# Altium schematic sheet TestProject.SchDoc
size A3; SheetNumber: 1; SheetTotal: 1
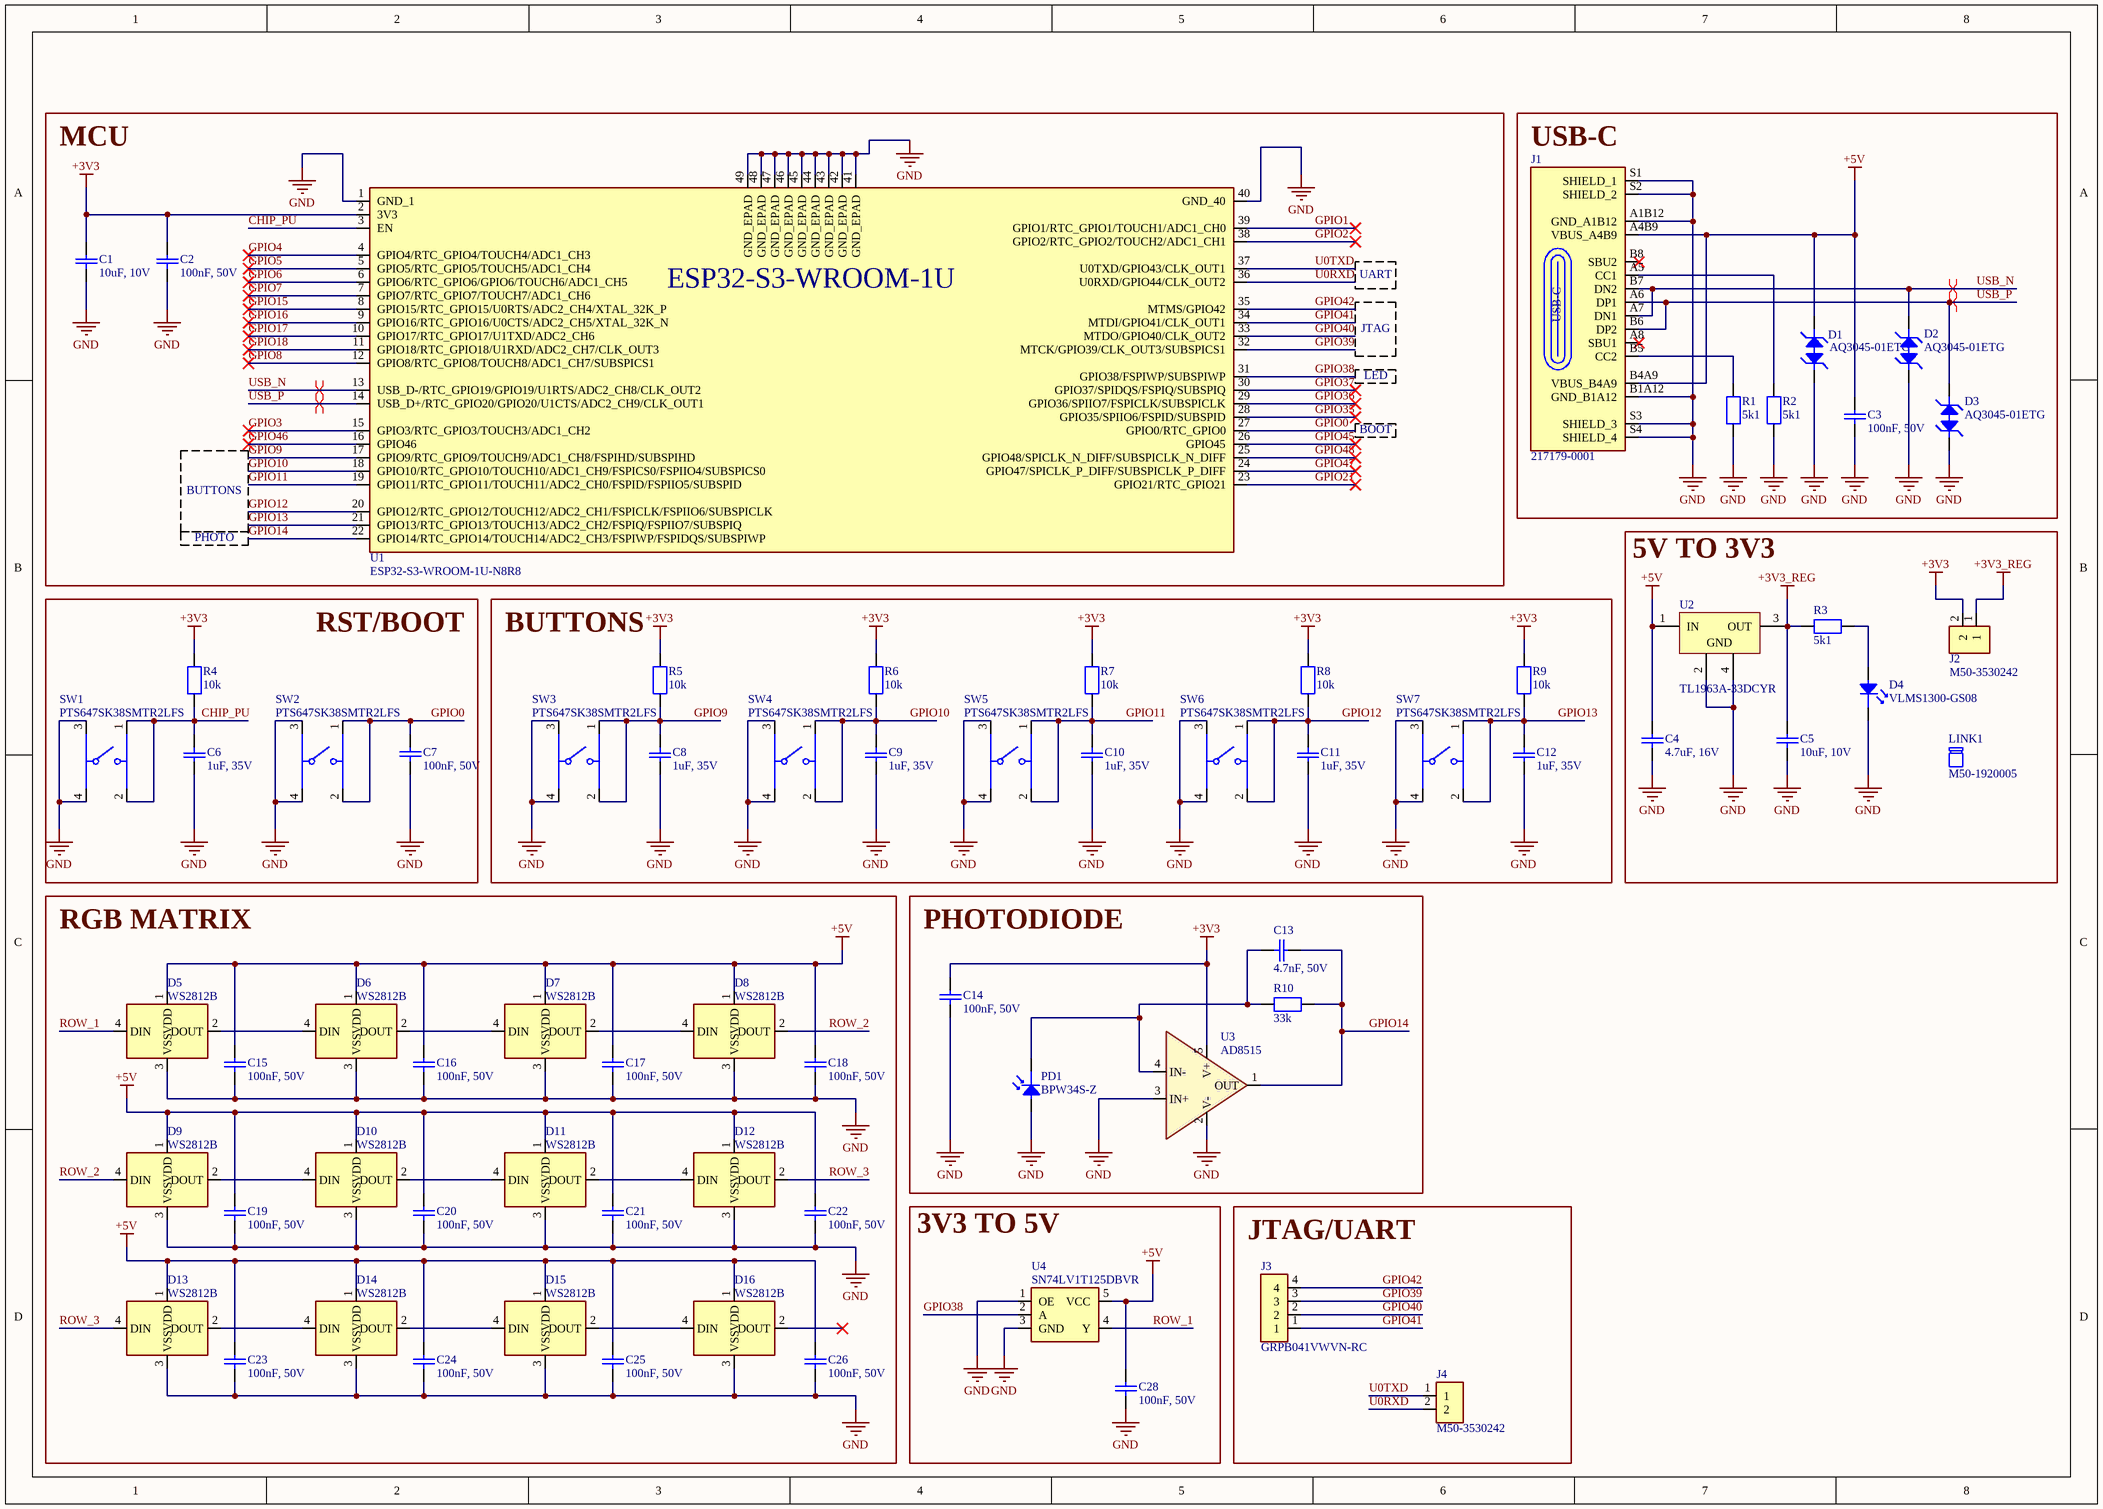
[diagram p0: TestProject.SchDoc]

## Parts
C1  10uF, 10V  [CAPC1005X70N]
C2  100nF, 50V  [CAPC1005X70N]
C3  100nF, 50V  [CAPC1005X70N]
C4  4.7uF, 16V  [CAPC1005X70N]
C5  10uF, 10V  [CAPC1005X70N]
C6  1uF, 35V  [CAPC1005X70N]
C7  100nF, 50V  [CAPC1005X70N]
C8  1uF, 35V  [CAPC1005X70N]
C9  1uF, 35V  [CAPC1005X70N]
C10  1uF, 35V  [CAPC1005X70N]
C11  1uF, 35V  [CAPC1005X70N]
C12  1uF, 35V  [CAPC1005X70N]
C13  4.7nF, 50V  [CAPC1005X70N]
C14  100nF, 50V  [CAPC1005X70N]
C15  100nF, 50V  [CAPC1005X70N]
C16  100nF, 50V  [CAPC1005X70N]
C17  100nF, 50V  [CAPC1005X70N]
C18  100nF, 50V  [CAPC1005X70N]
C19  100nF, 50V  [CAPC1005X70N]
C20  100nF, 50V  [CAPC1005X70N]
C21  100nF, 50V  [CAPC1005X70N]
C22  100nF, 50V  [CAPC1005X70N]
C23  100nF, 50V  [CAPC1005X70N]
C24  100nF, 50V  [CAPC1005X70N]
C25  100nF, 50V  [CAPC1005X70N]
C26  100nF, 50V  [CAPC1005X70N]
C28  100nF, 50V  [CAPC1005X70N]
D1  AQ3045-01ETG  [RTVS_SOD882_LTF]
D2  AQ3045-01ETG  [RTVS_SOD882_LTF]
D3  AQ3045-01ETG  [RTVS_SOD882_LTF]
D4  VLMS1300-GS08  [LED_VISHAY_VLMX1300_VIS]
D5  WS2812B  [COM-16347_SPK]
D6  WS2812B  [COM-16347_SPK]
D7  WS2812B  [COM-16347_SPK]
D8  WS2812B  [COM-16347_SPK]
D9  WS2812B  [COM-16347_SPK]
D10  WS2812B  [COM-16347_SPK]
D11  WS2812B  [COM-16347_SPK]
D12  WS2812B  [COM-16347_SPK]
D13  WS2812B  [COM-16347_SPK]
D14  WS2812B  [COM-16347_SPK]
D15  WS2812B  [COM-16347_SPK]
D16  WS2812B  [COM-16347_SPK]
J1  217179-0001  [FP-2171790001-MFG]
J2  M50-3530242  [HARWIN_M50-3530242]
J3  GRPB041VWVN-RC  [GRPB041VWVN-RC]
J4  M50-3530242  [HARWIN_M50-3530242]
LINK1  M50-1920005  (mechanical)
PD1  BPW34S-Z  [DIO_BPW_34_S-Z]
R1  5k1  [RESC1005X37N]
R2  5k1  [RESC1005X37N]
R3  5k1  [RESC1005X37N]
R4  10k  [RESC1005X37N]
R5  10k  [RESC1005X37N]
R6  10k  [RESC1005X37N]
R7  10k  [RESC1005X37N]
R8  10k  [RESC1005X37N]
R9  10k  [RESC1005X37N]
R10  33k  [RESC1005X37N]
SW1  PTS647SK38SMTR2LFS  [FP-PTS647SK38SMTR2LFS-MFG]
SW2  PTS647SK38SMTR2LFS  [FP-PTS647SK38SMTR2LFS-MFG]
SW3  PTS647SK38SMTR2LFS  [FP-PTS647SK38SMTR2LFS-MFG]
SW4  PTS647SK38SMTR2LFS  [FP-PTS647SK38SMTR2LFS-MFG]
SW5  PTS647SK38SMTR2LFS  [FP-PTS647SK38SMTR2LFS-MFG]
SW6  PTS647SK38SMTR2LFS  [FP-PTS647SK38SMTR2LFS-MFG]
SW7  PTS647SK38SMTR2LFS  [FP-PTS647SK38SMTR2LFS-MFG]
U1  ESP32-S3-WROOM-1U-N8R8  [XCVR_ESP32-S3-WROOM-1U]
U2  TL1963A-33DCYR  [DCY0004A_N]
U3  AD8515  [SOT95P280X145-5N]
U4  SN74LV1T125DBVR  [SOT95P280X145-5N]

## Blocks framed on the sheet
MCU: C1 C2 U1
USB-C: C3 D1-D3 J1 R1 R2
5V TO 3V3: C4 C5 D4 J2 LINK1 R3 U2
RST/BOOT: C6 C7 R4 SW1 SW2
BUTTONS: C8-C12 R5-R9 SW3-SW7
RGB MATRIX: C15-C26 D5-D16
PHOTODIODE: C13 C14 PD1 R10 U3
3V3 TO 5V: C28 U4
JTAG/UART: J3 J4

## Nets
+3V3: C1.2 C2.2 C14.2 J2.2 R4.2 R5.2 R6.2 R7.2 R8.2 R9.2 U1.2(3V3) U3.5(V+)
+3V3_REG: C5.2 J2.1 R3.2 U2.3(OUT)
+5V: C3.2 C4.2 C15.2 C16.2 C17.2 C18.2 C19.2 C20.2 C21.2 C22.2 C23.2 C24.2 C25.2 C26.2 C28.2 D1.2 D5.1(VDD) D6.1(VDD) D7.1(VDD) D8.1(VDD) D9.1(VDD) D10.1(VDD) D11.1(VDD) D12.1(VDD) D13.1(VDD) D14.1(VDD) D15.1(VDD) D16.1(VDD) J1.A4B9(VBUS_A4B9) J1.B4A9(VBUS_B4A9) U2.1(IN) U4.5(VCC)
GND: C1.1 C2.1 C3.1 C4.1 C5.1 C6.2 C7.1 C8.2 C9.2 C10.2 C11.2 C12.2 C14.1 C15.1 C16.1 C17.1 C18.1 C19.1 C20.1 C21.1 C22.1 C23.1 C24.1 C25.1 C26.1 C28.1 D1.1 D2.1 D3.1 D4.2 D5.3(VSS) D6.3(VSS) D7.3(VSS) D8.3(VSS) D9.3(VSS) D10.3(VSS) D11.3(VSS) D12.3(VSS) D13.3(VSS) D14.3(VSS) D15.3(VSS) D16.3(VSS) J1.A1B12(GND_A1B12) J1.B1A12(GND_B1A12) J1.S1(SHIELD_1) J1.S2(SHIELD_2) J1.S3(SHIELD_3) J1.S4(SHIELD_4) PD1.1 R1.1 R2.1 SW1.3 SW1.4 SW2.3 SW2.4 SW3.3 SW3.4 SW4.3 SW4.4 SW5.3 SW5.4 SW6.3 SW6.4 SW7.3 SW7.4 U1.1(GND_1) U1.40(GND_40) U1.41(GND_EPAD) U1.42(GND_EPAD) U1.43(GND_EPAD) U1.44(GND_EPAD) U1.45(GND_EPAD) U1.46(GND_EPAD) U1.47(GND_EPAD) U1.48(GND_EPAD) U1.49(GND_EPAD) U2.2(GND) U2.4(GND) U3.2(V-) U3.3(IN+) U4.1(OE) U4.3(GND)
CHIP_PU: C6.1 R4.1 SW1.1 SW1.2 U1.3(EN)
GPIO0: C7.2 SW2.1 SW2.2 U1.27(GPIO0/RTC_GPIO0)
GPIO1: U1.39(GPIO1/RTC_GPIO1/TOUCH1/ADC1_CH0)
GPIO2: U1.38(GPIO2/RTC_GPIO2/TOUCH2/ADC1_CH1)
GPIO3: U1.15(GPIO3/RTC_GPIO3/TOUCH3/ADC1_CH2)
GPIO4: U1.4(GPIO4/RTC_GPIO4/TOUCH4/ADC1_CH3)
GPIO5: U1.5(GPIO5/RTC_GPIO5/TOUCH5/ADC1_CH4)
GPIO6: U1.6(GPIO6/RTC_GPIO6/GPIO6/TOUCH6/ADC1_CH5)
GPIO7: U1.7(GPIO7/RTC_GPIO7/TOUCH7/ADC1_CH6)
GPIO8: U1.12(GPIO8/RTC_GPIO8/TOUCH8/ADC1_CH7/SUBSPICS1)
GPIO9: C8.1 R5.1 SW3.1 SW3.2 U1.17(GPIO9/RTC_GPIO9/TOUCH9/ADC1_CH8/FSPIHD/SUBSPIHD)
GPIO10: C9.1 R6.1 SW4.1 SW4.2 U1.18(GPIO10/RTC_GPIO10/TOUCH10/ADC1_CH9/FSPICS0/FSPIIO4/SUBSPICS0)
GPIO11: C10.1 R7.1 SW5.1 SW5.2 U1.19(GPIO11/RTC_GPIO11/TOUCH11/ADC2_CH0/FSPID/FSPIIO5/SUBSPID)
GPIO12: C11.1 R8.1 SW6.1 SW6.2 U1.20(GPIO12/RTC_GPIO12/TOUCH12/ADC2_CH1/FSPICLK/FSPIIO6/SUBSPICLK)
GPIO13: C12.1 R9.1 SW7.1 SW7.2 U1.21(GPIO13/RTC_GPIO13/TOUCH13/ADC2_CH2/FSPIQ/FSPIIO7/SUBSPIQ)
GPIO14: C13.2 R10.2 U1.22(GPIO14/RTC_GPIO14/TOUCH14/ADC2_CH3/FSPIWP/FSPIDQS/SUBSPIWP) U3.1(OUT)
GPIO15: U1.8(GPIO15/RTC_GPIO15/U0RTS/ADC2_CH4/XTAL_32K_P)
GPIO16: U1.9(GPIO16/RTC_GPIO16/U0CTS/ADC2_CH5/XTAL_32K_N)
GPIO17: U1.10(GPIO17/RTC_GPIO17/U1TXD/ADC2_CH6)
GPIO18: U1.11(GPIO18/RTC_GPIO18/U1RXD/ADC2_CH7/CLK_OUT3)
GPIO21: U1.23(GPIO21/RTC_GPIO21)
GPIO35: U1.28(GPIO35/SPIIO6/FSPID/SUBSPID)
GPIO36: U1.29(GPIO36/SPIIO7/FSPICLK/SUBSPICLK)
GPIO37: U1.30(GPIO37/SPIDQS/FSPIQ/SUBSPIQ)
GPIO38: U1.31(GPIO38/FSPIWP/SUBSPIWP) U4.2(A)
GPIO39: J3.3 U1.32(MTCK/GPIO39/CLK_OUT3/SUBSPICS1)
GPIO40: J3.2 U1.33(MTDO/GPIO40/CLK_OUT2)
GPIO41: J3.1 U1.34(MTDI/GPIO41/CLK_OUT1)
GPIO42: J3.4 U1.35(MTMS/GPIO42)
GPIO45: U1.26(GPIO45)
GPIO46: U1.16(GPIO46)
GPIO47: U1.24(GPIO47/SPICLK_P_DIFF/SUBSPICLK_P_DIFF)
GPIO48: U1.25(GPIO48/SPICLK_N_DIFF/SUBSPICLK_N_DIFF)
ROW_1: D5.4(DIN) U4.4(Y)
ROW_2: D8.2(DOUT) D9.4(DIN)
ROW_3: D12.2(DOUT) D13.4(DIN)
U0RXD: J4.2 U1.36(U0RXD/GPIO44/CLK_OUT2)
U0TXD: J4.1 U1.37(U0TXD/GPIO43/CLK_OUT1)
USB_N: D2.2 J1.A7(DN1) J1.B7(DN2) U1.13(USB_D-/RTC_GPIO19/GPIO19/U1RTS/ADC2_CH8/CLK_OUT2)
USB_P: D3.2 J1.A6(DP1) J1.B6(DP2) U1.14(USB_D+/RTC_GPIO20/GPIO20/U1CTS/ADC2_CH9/CLK_OUT1)
NetC13_1: C13.1 PD1.2 R10.1 U3.4(IN-)
NetD4_1: D4.1 R3.1
NetD5_2: D5.2(DOUT) D6.4(DIN)
NetD6_2: D6.2(DOUT) D7.4(DIN)
NetD7_2: D7.2(DOUT) D8.4(DIN)
NetD9_2: D9.2(DOUT) D10.4(DIN)
NetD10_2: D10.2(DOUT) D11.4(DIN)
NetD11_2: D11.2(DOUT) D12.4(DIN)
NetD13_2: D13.2(DOUT) D14.4(DIN)
NetD14_2: D14.2(DOUT) D15.4(DIN)
NetD15_2: D15.2(DOUT) D16.4(DIN)
NetJ1_A5: J1.A5(CC1) R2.2
NetJ1_B5: J1.B5(CC2) R1.2

Not connected (* = marked no-connect by the designer): D16 2(DOUT)*; J1 A8(SBU1)* B8(SBU2)*

## Layout directives
differential pair; differential pair class DIFF90: USB_N, USB_P

## Notes on the sheet
- UART
- JTAG
- LED
- BOOT
- BUTTONS
- PHOTO
- (in symbol 217179-0001) USB-C
- (in symbol ESP32-S3-WROOM-1U-N8R8) ESP32-S3-WROOM-1U

## Library data of the parts
C1 C5 = CL05A106MP5NRNC: CAP CER 10UF 10V X5R 0402; Manufacturer: Samsung; Dielectric Material: Ceramic; Multilayer: Yes; Tolerance  (fill in as +-): 20%; Supplier: Digikey; Supplier Part Number: 1276-CL05A106MP5NRNCCT-ND; Manufacturer Part Number: CL05A106MP5NRNC; RoHS: Yes; Category: Ceramic Capacitors; Stock: 49767; Pricing: 1=0,24, 10=0,141, 100=0,0894, 1000=0,06284, 2500=0,05624, 5000=0,05227 (USD); Mounting Technology: Surface Mount; Pins: 2; Package Shape: Rectangular; Case/Package: 0402; Terminal Finish: Nickel; Min Operating Temperature: -55°C; Max Operating Temperature: 85°C; JESD-609 Code: e3; Value: 10uF; Capacitor Type: Ceramic; Packaging: Tape and Reel; Tolerance (fill in as +-): 20%; Rated DC Voltage (URdc): 10V; Temperature Characteristics Code: X5R; Termination: Wraparound; Reach SVHC Compliant: Yes; RoHS Compliant: Yes; ComponentLink1URL: https://datasheet.ciiva.com:443/pdfs/VipMasterIC/IC/SEMS/SEMS-S-A0008520814/SEMS-S-A0008520734-1.pdf?src-supplier=IHS+Markit; ComponentLink1Description: https://datasheet.ciiva.com:443/pdfs/VipMasterIC/IC/SEMS/SEMS-S-A0008520814/SEMS-S-A0008520734-1.pdf?src-supplier=IHS+Markit; LCSC Part Number: C3035383
C2 C3 C7 C14-C26 C28 = CL05B104KB5NNNC: CAP CER 0.1UF 50V X7R 0402; Manufacturer: Samsung; Dielectric Material: Ceramic; Multilayer: Yes; Tolerance  (fill in as +-): 10%; Supplier: Digikey; Supplier Part Number: 1276-CL05B104KB5NNNCCT-ND; Manufacturer Part Number: CL05B104KB5NNNC; RoHS: Yes; Category: Ceramic Capacitors; Stock: 302298; Pricing: 1=0,08, 10=0,018, 100=0,012, 1000=0,008, 2500=0,00768 (USD); Mounting Technology: Surface Mount; Pins: 2; Package Shape: Rectangular; Case/Package: 0402; Terminal Finish: Nickel; Min Operating Temperature: -55°C; Max Operating Temperature: 125°C; JESD-609 Code: e3; Value: 100nF; Capacitor Type: Ceramic; Packaging: Tape and Reel; Tolerance (fill in as +-): 10%; Rated DC Voltage (URdc): 50V; Temperature Characteristics Code: X7R; Termination: Wraparound; Reach SVHC Compliant: Yes; RoHS Compliant: Yes; ComponentLink1URL: https://datasheet.ciiva.com:443/pdfs/VipMasterIC/IC/SEMS/SEMS-S-A0008523115/SEMS-S-A0008523176-1.pdf?src-supplier=IHS+Markit; ComponentLink1Description: https://datasheet.ciiva.com:443/pdfs/VipMasterIC/IC/SEMS/SEMS-S-A0008523115/SEMS-S-A0008523176-1.pdf?src-supplier=IHS+Markit; ComponentLink2URL: https://datasheet.octopart.com/CL05B104KB5NNNC-Samsung-datasheet-97040617.pdf?src-supplier=Future+Electronics; ComponentLink2Description: https://datasheet.octopart.com/CL05B104KB5NNNC-Samsung-datasheet-97040617.pdf?src-supplier=Future+Electronics; ComponentLink3URL: https://datasheet.octopart.com/CL05B104KB5NNNC-Samsung-datasheet-8326407.pdf?src-supplier=TME; ComponentLink3Description: https://datasheet.octopart.com/CL05B104KB5NNNC-Samsung-datasheet-8326407.pdf?src-supplier=TME; LCSC Part Number: C960916
C4 = CL05A475MO5NUNC: CAP CER 4.7UF 16V X5R 0402; Manufacturer: Samsung; Dielectric Material: Ceramic; Multilayer: Yes; Tolerance  (fill in as +-): 20%; Supplier: Digikey; Supplier Part Number: 1276-6836-1-ND; Manufacturer Part Number: CL05A475MO5NUNC; RoHS: Yes; Category: Ceramic Capacitors; Stock: 3323; Pricing: 1=0,15, 10=0,091, 100=0,0851 (USD); Mounting Technology: Surface Mount; Pins: 2; Package Shape: Rectangular; Case/Package: 0402; Terminal Finish: Nickel; Min Operating Temperature: -55°C; Max Operating Temperature: 85°C; JESD-609 Code: e3; Value: 4.7uF; Capacitor Type: Ceramic; Package Style: SMTMeter; Packaging: Tape and Reel; Tolerance (fill in as +-): 20%; Rated DC Voltage (URdc): 16V; Temperature Characteristics Code: X5R; Termination: Wraparound; Length: 1mm; Width: 0.5mm; Height: 0.7mm; Reach SVHC Compliant: Yes; RoHS Compliant: Yes; ComponentLink1URL: https://datasheet.ciiva.com:443/pdfs/VipMasterIC/IC/SEMS/SEMS-S-A0008384515/SEMS-S-A0008898881-1.pdf?src-supplier=IHS+Markit; ComponentLink1Description: https://datasheet.ciiva.com:443/pdfs/VipMasterIC/IC/SEMS/SEMS-S-A0008384515/SEMS-S-A0008898881-1.pdf?src-supplier=IHS+Markit; ComponentLink2URL: http://www.farnell.com/datasheets/2710653.pdf?src-supplier=Farnell; ComponentLink2Description: http://www.farnell.com/datasheets/2710653.pdf?src-supplier=Farnell; ComponentLink3URL: http://www.samsungsem.com/kr/support/product-search/mlcc/CL05A475MO5NUNC.jsp?src-supplier=Digikey; ComponentLink3Description: http://www.samsungsem.com/kr/support/product-search/mlcc/CL05A475MO5NUNC.jsp?src-supplier=Digikey; ComponentLink4URL: http://www.farnell.com/datasheets/2710653.pdf?src-supplier=Newark; ComponentLink4Description: http://www.farnell.com/datasheets/2710653.pdf?src-supplier=Newark; ComponentLink5URL: http://www.farnell.com/datasheets/2710653.pdf?src-supplier=Element14; ComponentLink5Description: http://www.farnell.com/datasheets/2710653.pdf?src-supplier=Element14; ComponentLink6URL: https://datasheet.octopart.com/CL05A475MO5NUNC-Samsung-Electro-Mechanics-datasheet-123102911.pdf?src-supplier=Future+Electronics; ComponentLink6Description: https://datasheet.octopart.com/CL05A475MO5NUNC-Samsung-Electro-Mechanics-datasheet-123102911.pdf?src-supplier=Future+Electronics; LCSC Part Number: C318563
C6 C8-C12 = CL05A105KL5NRNC: CAP CER 1UF 35V X5R 0402; Manufacturer: Samsung; Dielectric Material: Ceramic; Multilayer: Yes; Tolerance  (fill in as +-): 10%; Supplier: Digikey; Supplier Part Number: 1276-6796-1-ND; Manufacturer Part Number: CL05A105KL5NRNC; RoHS: Yes; Category: Ceramic Capacitors; Stock: 72807; Pricing: 1=0,29, 10=0,17, 100=0,1097, 1000=0,07829, 2500=0,07048, 5000=0,06578 (USD); Mounting Technology: Surface Mount; Pins: 2; Package Shape: Rectangular; Case/Package: 0402; Terminal Finish: Nickel; Min Operating Temperature: -55°C; Max Operating Temperature: 85°C; JESD-609 Code: e3; Value: 1uF; Capacitor Type: Ceramic; Packaging: Tape and Reel; Tolerance (fill in as +-): 10%; Rated DC Voltage (URdc): 35V; Temperature Characteristics Code: X5R; Termination: Wraparound; Reach SVHC Compliant: Yes; RoHS Compliant: Yes; ComponentLink1URL: https://datasheet.ciiva.com:443/pdfs/VipMasterIC/IC/SEMS/SEMS-S-A0008384515/SEMS-S-A0008872905-1.pdf?src-supplier=IHS+Markit; ComponentLink1Description: https://datasheet.ciiva.com:443/pdfs/VipMasterIC/IC/SEMS/SEMS-S-A0008384515/SEMS-S-A0008872905-1.pdf?src-supplier=IHS+Markit; ComponentLink2URL: http://www.samsungsem.com/kr/support/product-search/mlcc/CL05A105KL5NRNC.jsp?src-supplier=Digikey; ComponentLink2Description: http://www.samsungsem.com/kr/support/product-search/mlcc/CL05A105KL5NRNC.jsp?src-supplier=Digikey; ComponentLink3URL: https://datasheet.octopart.com/CL05A105KL5NRNC-Samsung-datasheet-8326407.pdf?src-supplier=TME; ComponentLink3Description: https://datasheet.octopart.com/CL05A105KL5NRNC-Samsung-datasheet-8326407.pdf?src-supplier=TME; LCSC Part Number: C307413
C13 = CL05B472KB5VPNC: CAP CER 4700PF 50V X7R 0402; Manufacturer: Samsung; Dielectric Material: Ceramic; Multilayer: Yes; Tolerance  (fill in as +-): 10%; Reference Standard: AEC-Q200; Supplier: Digikey; Supplier Part Number: 1276-6576-1-ND; Manufacturer Part Number: CL05B472KB5VPNC; RoHS: Yes; Category: Ceramic Capacitors; Stock: 112941; Pricing: 1=0,1, 10=0,031, 100=0,0179, 1000=0,01116, 2500=0,0095, 5000=0,00851 (USD); Mounting Technology: Surface Mount; Pins: 2; Package Shape: Rectangular; Case/Package: 0402; Terminal Finish: Nickel; Min Operating Temperature: -55°C; Max Operating Temperature: 125°C; JESD-609 Code: e3; Value: 4.7nF; Capacitor Type: Ceramic; Packaging: Tape and Reel; Tolerance (fill in as +-): 10%; Rated DC Voltage (URdc): 50V; Temperature Characteristics Code: X7R; Termination: Wraparound; Reach SVHC Compliant: Yes; RoHS Compliant: Yes; ComponentLink1URL: https://datasheet.ciiva.com:443/pdfs/VipMasterIC/IC/SEMS/SEMS-S-A0007757376/SEMS-S-A0007757405-1.pdf?src-supplier=IHS+Markit; ComponentLink1Description: https://datasheet.ciiva.com:443/pdfs/VipMasterIC/IC/SEMS/SEMS-S-A0007757376/SEMS-S-A0007757405-1.pdf?src-supplier=IHS+Markit; ComponentLink2URL: http://www.samsungsem.com/kr/support/product-search/mlcc/CL05B472KB5VPNC.jsp?src-supplier=Digikey; ComponentLink2Description: http://www.samsungsem.com/kr/support/product-search/mlcc/CL05B472KB5VPNC.jsp?src-supplier=Digikey; ComponentLink3URL: http://www.samsungsem.com/kr/support/library/product-catalog/mlcc.jsp?src-supplier=Digikey; ComponentLink3Description: http://www.samsungsem.com/kr/support/library/product-catalog/mlcc.jsp?src-supplier=Digikey; ComponentLink4URL: http://www.samsungsem.com/servlet/FileDownload?type=spec&file=CL05B472KB5VPNC.pdf&src-supplier=Avnet; ComponentLink4Description: http://www.samsungsem.com/servlet/FileDownload?type=spec&file=CL05B472KB5VPNC.pdf&src-supplier=Avnet; ComponentLink5URL: https://datasheet.octopart.com/CL05B472KB5VPNC-Samsung-Electro-Mechanics-datasheet-133510618.pdf?src-supplier=Future+Electronics; ComponentLink5Description: https://datasheet.octopart.com/CL05B472KB5VPNC-Samsung-Electro-Mechanics-datasheet-133510618.pdf?src-supplier=Future+Electronics; LCSC Part Number: C307338
D1-D3 = AQ3045-01ETG: TVS DIODE 5.3VWM 12VC SOD882; Manufacturer: Littelfuse; Diode Element Material: SILICON; Package Body Material: Plastic; Polarity: Bidirectional; Max Breakdown Voltage: 9V; Min Breakdown Voltage: 6.8V; Diode Type: TRANS VOLTAGE SUPPRESSOR; Non-rep Peak Rev Power Dis-Max: 40W; Number of Elements: 1; Rep Pk Reverse Voltage-Max: 5.3V; Reference Standard: AEC-Q101; Supplier: Digikey; Supplier Part Number: F9321CT-ND; Manufacturer Part Number: AQ3045-01ETG; RoHS: Yes; Category: TVS Diodes; Stock: 7460; Pricing: 1=0,45, 10=0,29, 100=0,141, 500=0,134, 1000=0,131 (USD); Pins: 2; Package Shape: Rectangular; Min Operating Temperature: -55°C; Max Operating Temperature: 150°C; Package Style: CHIP CARRIERMeter; Surface Mount: Yes; Technology: AVALANCHE; Terminal Form: No Lead; Terminal Position: BOTTOM; Reach SVHC Compliant: Yes; RoHS Compliant: Yes; ComponentLink1URL: https://datasheet.ciiva.com:443/pdfs/VipMasterIC/IC/LFSI/LFSI-S-A0007892042/LFSI-S-A0007892042-1.pdf?src-supplier=IHS+Markit; ComponentLink1Description: https://datasheet.ciiva.com:443/pdfs/VipMasterIC/IC/LFSI/LFSI-S-A0007892042/LFSI-S-A0007892042-1.pdf?src-supplier=IHS+Markit; ComponentLink2URL: https://www.littelfuse.com/~/media/electronics/datasheets/tvs_diode_arrays/littelfuse_tvs_diode_array_aq3045_datasheet.pdf.pdf?src-supplier=Digikey; ComponentLink2Description: https://www.littelfuse.com/~/media/electronics/datasheets/tvs_diode_arrays/littelfuse_tvs_diode_array_aq3045_datasheet.pdf.pdf?src-supplier=Digikey; ComponentLink3URL: http://www.littelfuse.com/~/media/electronics/datasheets/tvs_diode_arrays/littelfuse_tvs_diode_array_aq3045_datasheet.pdf.pdf?src-supplier=Digikey; ComponentLink3Description: http://www.littelfuse.com/~/media/electronics/datasheets/tvs_diode_arrays/littelfuse_tvs_diode_array_aq3045_datasheet.pdf.pdf?src-supplier=Digikey; LCSC Part Number: C3710326
D4 = VLMS1300-GS08: LED RED 0603 SMD; Manufacturer: Vishay Semiconductors; Shape: Rectangular; Additional Feature: HIGH RELIABILITY; Forward Current: 30mA; Forward Voltage: 2.4V; Luminous Intensity-Nom: 54mcd; Channels: 1; Optoelectronic Device Type: SINGLE COLOR LED; Reverse Voltage-Max: 5V; Viewing Angle: 130°; Overall Height: 0.8mm; Supplier: Digikey; Supplier Part Number: VLMS1300-GS08CT-ND; Manufacturer Part Number: VLMS1300-GS08; RoHS: Yes; Category: LEDs; Stock: 56745; Pricing: 1=0,21, 10=0,143, 100=0,0998, 500=0,07982, 1000=0,07322 (USD); Mounting Technology: Surface Mount; Pins: 2; Color: Red; Color@wavelength: Red; Min Operating Temperature: -35°C; Max Operating Temperature: 85°C; Packaging: Tape and Reel; Size: 1.1mm; Terminal Pitch: 1.5mm; Reach SVHC Compliant: Yes; RoHS Compliant: Yes; ComponentLink1URL: https://datasheet.ciiva.com:443/pdfs/VipMasterIC/IC/VISH/VISH-S-A0004564149/VISH-S-A0004564149-1.pdf?src-supplier=IHS+Markit; ComponentLink1Description: https://datasheet.ciiva.com:443/pdfs/VipMasterIC/IC/VISH/VISH-S-A0004564149/VISH-S-A0004564149-1.pdf?src-supplier=IHS+Markit; ComponentLink2URL: https://datasheet.ciiva.com/2114/vlmo1300-2114931.pdf?src-supplier=Digikey; ComponentLink2Description: https://datasheet.ciiva.com/2114/vlmo1300-2114931.pdf?src-supplier=Digikey; ComponentLink3URL: https://datasheet.ciiva.com/26322/vlmo1300-26322153.pdf?src-supplier=Element14; ComponentLink3Description: https://datasheet.ciiva.com/26322/vlmo1300-26322153.pdf?src-supplier=Element14; ComponentLink4URL: https://datasheet.ciiva.com/8028/vlmo1300-8028047.pdf?src-supplier=Element14; ComponentLink4Description: https://datasheet.ciiva.com/8028/vlmo1300-8028047.pdf?src-supplier=Element14; LCSC Part Number: C83242
D5-D16 = 16347: ADDRESS LED RED/GRN/BLUE; Manufacturer: SparkFun; Supplier: Digikey; Supplier Part Number: 1568-16347CT-ND; Manufacturer Part Number: 16347; RoHS: No; Stock: 44982; Pricing: 1=0,68 (USD); LCSC Part Number: C7433145
J1 = 217179-0001: CONN RCP USB2.0 TYP C 24P SMD RA; Manufacturer: Molex; Supplier: Digikey; Supplier Part Number: 900-2171790001CT-ND; Manufacturer Part Number: 217179-0001; RoHS: No; Category: Connectors; Stock: 20923; Pricing: 1=0,83, 10=0,704, 25=0,6596, 50=0,628, 100=0,598, 250=0,56052, 500=0,53374 (USD); LCSC Part Number: C3197684
J2 J4 = M50-3530242: CONN HEADER VERT 2POS 1.27MM; Manufacturer: Harwin; Connector Type: BOARD CONNECTOR; Option: General Purpose; Filter Feature: No; Number of Rows Loaded: 1; Number of Contacts: 2; Supplier: Digikey; Supplier Part Number: 952-3598-ND; Manufacturer Part Number: M50-3530242; RoHS: Yes; Category: Headers and Wire Housings; Stock: 31275; Pricing: 1=0,1, 10=0,084, 100=0,0713, 500=0,06358, 1000=0,06054, 5000=0,05403, 10000=0,05145 (USD); Mounting Technology: Board; Contact Finish - Mating: NOT SPECIFIED; Contact Gender: Male; Mixed Contacts: No; Mounting Style: STRAIGHT; Termination: Solder; Terminal Pitch: 1.27mm; Flammability Rating: UL94 V-0; Reach SVHC Compliant: Yes; RoHS Compliant: Yes; DIN Conformance: No; IEC Conformance: No; MIL Conformance: No; ComponentLink1URL: https://datasheet.ciiva.com:443/pdfs/VipMasterIC/IC/HRWN/HRWN-S-A0002541787/HRWN-S-A0002541787-1.pdf?src-supplier=IHS+Markit; ComponentLink1Description: https://datasheet.ciiva.com:443/pdfs/VipMasterIC/IC/HRWN/HRWN-S-A0002541787/HRWN-S-A0002541787-1.pdf?src-supplier=IHS+Markit; ComponentLink2URL: https://cdn.harwin.com/pdfs/Harwin_PC_Connectors_Archer.pdf?src-supplier=Digikey; ComponentLink2Description: https://cdn.harwin.com/pdfs/Harwin_PC_Connectors_Archer.pdf?src-supplier=Digikey; LCSC Part Number: C3325334
J3 = GRPB041VWVN-RC: CONN HEADER VERT 4POS 1.27MM; Manufacturer: Sullins; Manufacturer Series: GRPB; Connector Type: BOARD CONNECTOR; Option: General Purpose; Filter Feature: No; Number of Rows Loaded: 1; Number of Contacts: 4; Supplier: Digikey; Supplier Part Number: S9014E-04-ND; Manufacturer Part Number: GRPB041VWVN-RC; RoHS: Yes; Category: Connectors; Stock: 10602; Pricing: 1=0,25, 10=0,212, 100=0,1804, 500=0,16098, 1000=0,15328, 5000=0,13682, 10000=0,13029 (USD); Mounting Technology: Board; Contact Material: Brass; Contact Finish - Mating: GOLD FLASH; Contact Finish - Termination: GOLD FLASH; JESD-609 Code: e4; Contact Gender: Male; Mixed Contacts: No; Mounting Style: STRAIGHT; Termination: Solder; Terminal Pitch: 1.27mm; Flammability Rating: UL94 V-0; Reach SVHC Compliant: Yes; RoHS Compliant: Yes; DIN Conformance: No; IEC Conformance: No; MIL Conformance: No; ComponentLink1URL: https://datasheet.ciiva.com:443/pdfs/VipMasterIC/IC/SUCS/SUCSS00161/SUCSS00161-1.pdf?src-supplier=IHS+Markit; ComponentLink1Description: https://datasheet.ciiva.com:443/pdfs/VipMasterIC/IC/SUCS/SUCSS00161/SUCSS00161-1.pdf?src-supplier=IHS+Markit; ComponentLink2URL: https://datasheet.ciiva.com/726/71-grpb-1vwvn-rc-10957-c-726650.pdf?src-supplier=Digikey; ComponentLink2Description: https://datasheet.ciiva.com/726/71-grpb-1vwvn-rc-10957-c-726650.pdf?src-supplier=Digikey; LCSC Part Number: C7198233
LINK1 = M50-1920005: CONN SHUNT 1.27MM RED; Manufacturer: Harwin; Manufacturer Series: M50; Connector Type: Interconnection Device; Body/Shell Style: PLUG; Contact Pattern: RECTANGULAR; Contact Resistance: 20mR; Dielectric Withstanding Voltage (AC): 500V; Durability: 300Cycles; Insulation Resistance: 1GR; Number Of Connectors: 1; Rated Current (Signal): 1A; Number of Contacts: 2; Body Breadth: 0.059inch; Body Depth: 0.118inch; Body Length: 0.098inch; Mating Contact Pitch: 0.05inch; Reference Standard: UL; Reliability: COMMERCIAL; Supplier: Digikey; Supplier Part Number: 952-1727-ND; Manufacturer Part Number: M50-1920005; RoHS: Yes; Category: Headers and Wire Housings; Stock: 4343; Pricing: 1=0,33, 10=0,284, 25=0,2664, 50=0,2536, 100=0,2414, 250=0,22628, 500=0,21546, 1000=0,20516, 3000=0,18984 (USD); Contact Material: Copper Alloy; Contact Finish - Mating: AU ON NI; Contact Finish - Termination: Gold (Au); Insulation Color: Red; Insulation Material: Nylon; Min Operating Temperature: -40°C; Max Operating Temperature: 105°C; JESD-609 Code: e4; Contact Gender: Female; Mounting Style: STRAIGHT; Number of Rows Loaded: 1; Reach SVHC Compliant: Yes; RoHS Compliant: Yes; ComponentLink1URL: https://datasheet.ciiva.com:443/pdfs/VipMasterIC/IC/HRWN/HRWNS04645/HRWNS04645-1.pdf?src-supplier=IHS+Markit; ComponentLink1Description: https://datasheet.ciiva.com:443/pdfs/VipMasterIC/IC/HRWN/HRWNS04645/HRWNS04645-1.pdf?src-supplier=IHS+Markit; ComponentLink2URL: https://datasheet.ciiva.com/4573/m50-19x-350826-4573042.pdf?src-supplier=Mouser; ComponentLink2Description: https://datasheet.ciiva.com/4573/m50-19x-350826-4573042.pdf?src-supplier=Mouser; ComponentLink3URL: https://datasheet.ciiva.com/767/m50-19x-767921.pdf?src-supplier=Digikey; ComponentLink3Description: https://datasheet.ciiva.com/767/m50-19x-767921.pdf?src-supplier=Digikey; ComponentLink4URL: https://datasheet.ciiva.com/1456/m50-19x-1456640.pdf?src-supplier=Newark; ComponentLink4Description: https://datasheet.ciiva.com/1456/m50-19x-1456640.pdf?src-supplier=Newark; ComponentLink5URL: https://datasheet.ciiva.com/1412/1836978-1412125.pdf?src-supplier=Element14; ComponentLink5Description: https://datasheet.ciiva.com/1412/1836978-1412125.pdf?src-supplier=Element14; LCSC Part Number: C6985646
PD1 = BPW34S-Z: SENSOR PHOTODIODE 850NM 2SMD GW; Manufacturer: Osram Opto; Shape: Square; Dark Current-Max: 30nA; Infrared Range: Yes; Light Current-Nom: 50uA; Channels: 1; Optoelectronic Device Type: PIN PHOTODIODE; Reverse Breakdown Voltage-Min: 32V; Supplier: Digikey; Supplier Part Number: 475-BPW34S-ZCT-ND; Manufacturer Part Number: BPW34S-Z; RoHS: Yes; Category: Phototransistor; Stock: 32968; Pricing: 1=1,17, 10=0,824, 100=0,6131, 500=0,51934 (USD); Terminal Finish: Tin; Min Operating Temperature: -40°C; Max Operating Temperature: 100°C; JESD-609 Code: e3; Size: 2.65mm; Reach SVHC Compliant: Yes; RoHS Compliant: Yes; ComponentLink1URL: https://datasheet.ciiva.com:443/pdfs/VipMasterIC/IC/OSOS/OSOS-S-A0005288917/OSOS-S-A0005288917-1.pdf?src-supplier=IHS+Markit; ComponentLink1Description: https://datasheet.ciiva.com:443/pdfs/VipMasterIC/IC/OSOS/OSOS-S-A0005288917/OSOS-S-A0005288917-1.pdf?src-supplier=IHS+Markit; ComponentLink2URL: https://datasheet.ciiva.com/2819/bpw34-spdf-2819825.pdf?src-supplier=Digikey; ComponentLink2Description: https://datasheet.ciiva.com/2819/bpw34-spdf-2819825.pdf?src-supplier=Digikey; ComponentLink3URL: https://datasheet.ciiva.com/2819/bpw34-spdf-2819826.pdf?src-supplier=Digikey; ComponentLink3Description: https://datasheet.ciiva.com/2819/bpw34-spdf-2819826.pdf?src-supplier=Digikey; ComponentLink4URL: https://datasheet.ciiva.com/2819/bpw34-spdf-2819827.pdf?src-supplier=Digikey; ComponentLink4Description: https://datasheet.ciiva.com/2819/bpw34-spdf-2819827.pdf?src-supplier=Digikey; LCSC Part Number: C67891
R1-R3 = AC0402FR-075K1L: RES SMD 5.1K OHM 1% 1/16W 0402; Manufacturer: Yageo; Value: 5.1kR; Power Rating: 63mW; Temperature Coefficient: 100ppm/°C; Voltage Rating: 50V; Supplier: Digikey; Supplier Part Number: YAG3503CT-ND; Manufacturer Part Number: AC0402FR-075K1L; RoHS: Yes; Category: Chip SMD Resistors; Stock: 60988; Pricing: 1=0,1, 10=0,009, 100=0,0071, 1000=0,00612, 2500=0,0051, 5000=0,00407 (USD); Mounting Technology: Surface Mount; Case/Package: 0402; Case Code (Metric): 1005; Case Code (Imperial): 0402; Min Operating Temperature: -55°C; Max Operating Temperature: 155°C; Tolerance: 1%; Number of Terminations: 2; Max Power Dissipation: 63mW; Features: Moisture Resistant,Automotive AEC-Q200; Packaging: Cut Tape; Series: AC; Length: 0.039inch; Width: 0.02inch; Height: 0.015inch; Lead Free: 5697LeadFree; RoHS Compliant: Yes; ComponentLink1URL: https://datasheet.octopart.com/AC0402FR-075K1L-Yageo-datasheet-166720450.pdf?src-supplier=Future+Electronics; ComponentLink1Description: https://datasheet.octopart.com/AC0402FR-075K1L-Yageo-datasheet-166720450.pdf?src-supplier=Future+Electronics; ComponentLink2URL: http://www.yageo.com/NewPortal/yageodocoutput?fileName=/pdf/R-Chip/PYu-AC_51_RoHS_L_6.pdf&src-supplier=Digikey; ComponentLink2Description: http://www.yageo.com/NewPortal/yageodocoutput?fileName=/pdf/R-Chip/PYu-AC_51_RoHS_L_6.pdf&src-supplier=Digikey; ComponentLink3URL: http://www.yageo.com/documents/recent/PYu-AC_51_RoHS_L_2_revised.pdf?src-supplier=Future+Electronics; ComponentLink3Description: http://www.yageo.com/documents/recent/PYu-AC_51_RoHS_L_2_revised.pdf?src-supplier=Future+Electronics; ComponentLink4URL: https://datasheet.octopart.com/AC0402FR-075K1L-Yageo-datasheet-178509465.pdf?src-supplier=Newark; ComponentLink4Description: https://datasheet.octopart.com/AC0402FR-075K1L-Yageo-datasheet-178509465.pdf?src-supplier=Newark; ComponentLink5URL: https://datasheet.octopart.com/AC0402FR-075K1L-Yageo-datasheet-178509465.pdf?src-supplier=Farnell; ComponentLink5Description: https://datasheet.octopart.com/AC0402FR-075K1L-Yageo-datasheet-178509465.pdf?src-supplier=Farnell; ComponentLink6URL: https://datasheet.octopart.com/AC0402FR-075K1L-Yageo-datasheet-178509465.pdf?src-supplier=Element14; ComponentLink6Description: https://datasheet.octopart.com/AC0402FR-075K1L-Yageo-datasheet-178509465.pdf?src-supplier=Element14; LCSC Part Number: C144745
R4-R9 = AC0402FR-0710KL: RES SMD 10K OHM 1% 1/16W 0402; Manufacturer: Yageo; Additional Feature: LASER TRIMMABLE; Power: 62.5mW; Rated Temperature: 70°C; Value: 10kR; Working Voltage: 50V; Temperature Coefficient (ppm/Cel): 100; Package Height: 0.32mm; Package Length: 1mm; Package Width: 0.5mm; Reference Standard: AEC-Q200; Supplier: Digikey; Supplier Part Number: YAG3436CT-ND; Manufacturer Part Number: AC0402FR-0710KL; RoHS: Yes; Category: Chip SMD Resistors; Stock: 624823; Pricing: 1=0,1, 10=0,009, 100=0,0082, 1000=0,00612, 2500=0,0051, 5000=0,00407 (USD); Mounting Technology: Surface Mount; Pins: 2; Package Shape: Rectangular; Case/Package: 0402; Terminal Finish: Nickel; Min Operating Temperature: -55°C; Max Operating Temperature: 155°C; Tolerance: 1%; JESD-609 Code: e3; Resistor Type: FIXED RESISTOR; Construction: Chip; Packaging: Tape and Reel; Technology: METAL GLAZE/THICK FILM; Termination: Wraparound; Reach SVHC Compliant: Yes; RoHS Compliant: Yes; ComponentLink1URL: https://datasheet.ciiva.com:443/pdfs/VipMasterIC/IC/YAGO/YAGO-S-A0003597364/YAGO-S-A0003597364-1.pdf?src-supplier=IHS+Markit; ComponentLink1Description: https://datasheet.ciiva.com:443/pdfs/VipMasterIC/IC/YAGO/YAGO-S-A0003597364/YAGO-S-A0003597364-1.pdf?src-supplier=IHS+Markit; ComponentLink2URL: https://datasheet.ciiva.com/12656/pyu-ac-51-rohs-l-2-12656634.pdf?src-supplier=Mouser; ComponentLink2Description: https://datasheet.ciiva.com/12656/pyu-ac-51-rohs-l-2-12656634.pdf?src-supplier=Mouser; LCSC Part Number: C144807
R10 = AC0402FR-0733KL: RES SMD 33K OHM 1% 1/16W 0402; Manufacturer: Yageo; Additional Feature: LASER TRIMMABLE; Power: 62.5mW; Rated Temperature: 70°C; Value: 33kR; Working Voltage: 50V; Temperature Coefficient (ppm/Cel): 100; Package Height: 0.32mm; Package Length: 1mm; Package Width: 0.5mm; Reference Standard: AEC-Q200; Supplier: Digikey; Supplier Part Number: YAG3477CT-ND; Manufacturer Part Number: AC0402FR-0733KL; RoHS: Yes; Category: Chip SMD Resistors; Stock: 108993; Pricing: 1=0,1, 10=0,011, 100=0,0082, 1000=0,00612, 2500=0,0051, 5000=0,00407 (USD); Mounting Technology: Surface Mount; Pins: 2; Package Shape: Rectangular; Case/Package: 0402; Terminal Finish: Nickel; Min Operating Temperature: -55°C; Max Operating Temperature: 155°C; Tolerance: 1%; JESD-609 Code: e3; Resistor Type: FIXED RESISTOR; Construction: Chip; Packaging: Tape and Reel; Technology: METAL GLAZE/THICK FILM; Termination: Wraparound; Reach SVHC Compliant: Yes; RoHS Compliant: Yes; ComponentLink1URL: https://datasheet.ciiva.com:443/pdfs/VipMasterIC/IC/YAGO/YAGO-S-A0003597364/YAGO-S-A0003597364-1.pdf?src-supplier=IHS+Markit; ComponentLink1Description: https://datasheet.ciiva.com:443/pdfs/VipMasterIC/IC/YAGO/YAGO-S-A0003597364/YAGO-S-A0003597364-1.pdf?src-supplier=IHS+Markit; ComponentLink2URL: https://datasheet.octopart.com/AC0402FR-0733KL-Yageo-datasheet-178509465.pdf?src-supplier=Farnell; ComponentLink2Description: https://datasheet.octopart.com/AC0402FR-0733KL-Yageo-datasheet-178509465.pdf?src-supplier=Farnell; ComponentLink3URL: http://www.yageo.com/NewPortal/yageodocoutput?fileName=/pdf/R-Chip/PYu-AC_51_RoHS_L_6.pdf&src-supplier=Digikey; ComponentLink3Description: http://www.yageo.com/NewPortal/yageodocoutput?fileName=/pdf/R-Chip/PYu-AC_51_RoHS_L_6.pdf&src-supplier=Digikey; ComponentLink4URL: https://www.yageo.com/upload/media/product/productsearch/datasheet/rchip/PYu-AC_51_RoHS_L_7.pdf?src-supplier=Digikey; ComponentLink4Description: https://www.yageo.com/upload/media/product/productsearch/datasheet/rchip/PYu-AC_51_RoHS_L_7.pdf?src-supplier=Digikey; ComponentLink5URL: https://datasheet.octopart.com/AC0402FR-0733KL-Yageo-datasheet-178509465.pdf?src-supplier=Element14; ComponentLink5Description: https://datasheet.octopart.com/AC0402FR-0733KL-Yageo-datasheet-178509465.pdf?src-supplier=Element14; ComponentLink6URL: https://datasheet.octopart.com/AC0402FR-0733KL-Yageo-datasheet-178509465.pdf?src-supplier=Newark; ComponentLink6Description: https://datasheet.octopart.com/AC0402FR-0733KL-Yageo-datasheet-178509465.pdf?src-supplier=Newark; ComponentLink7URL: https://datasheet.octopart.com/AC0402FR-0733KL-Yageo-datasheet-166720450.pdf?src-supplier=Future+Electronics; ComponentLink7Description: https://datasheet.octopart.com/AC0402FR-0733KL-Yageo-datasheet-166720450.pdf?src-supplier=Future+Electronics; ComponentLink8URL: http://www.yageo.com/documents/recent/PYu-AC_51_RoHS_L_2_revised.pdf?src-supplier=Future+Electronics; ComponentLink8Description: http://www.yageo.com/documents/recent/PYu-AC_51_RoHS_L_2_revised.pdf?src-supplier=Future+Electronics; ComponentLink9URL: https://datasheet.octopart.com/AC0402FR-0733KL-Yageo-datasheet-140571090.pdf?src-supplier=Arrow.cn; ComponentLink9Description: https://datasheet.octopart.com/AC0402FR-0733KL-Yageo-datasheet-140571090.pdf?src-supplier=Arrow.cn; LCSC Part Number: C138291
SW1-SW7 = PTS647SK38SMTR2LFS: SWITCH TACTILE SPST-NO 0.05A 12V; Manufacturer: ITT C&K; Supplier: Digikey; Supplier Part Number: PTS647SK38SMTR2LFSCT-ND; Manufacturer Part Number: PTS647SK38SMTR2LFS; RoHS: No; Category: Tactile Switches; Stock: 4966; Pricing: 1=0,26, 10=0,226, 25=0,2116, 100=0,1897, 250=0,17588, 500=0,16596, 1000=0,15666 (USD); RoHS Compliant: Yes; ComponentLink1URL: http://datasheet.octopart.com/PTS647SK38SMTR2LFS-C%26K-Components-datasheet-117317067.pdf?src-supplier=Digikey; ComponentLink1Description: http://datasheet.octopart.com/PTS647SK38SMTR2LFS-C%26K-Components-datasheet-117317067.pdf?src-supplier=Digikey; ComponentLink2URL: https://www.ckswitches.com/media/2567/pts647.pdf?src-supplier=Digikey; ComponentLink2Description: https://www.ckswitches.com/media/2567/pts647.pdf?src-supplier=Digikey; ComponentLink3URL: http://datasheet.octopart.com/PTS647SK38SMTR2LFS-C%26K-Components-datasheet-117317067.pdf?src-supplier=Avnet; ComponentLink3Description: http://datasheet.octopart.com/PTS647SK38SMTR2LFS-C%26K-Components-datasheet-117317067.pdf?src-supplier=Avnet; ComponentLink4URL: http://datasheet.octopart.com/PTS647SK38SMTR2LFS-C%26K-Components-datasheet-117317067.pdf?src-supplier=Arrow+Electronics; ComponentLink4Description: http://datasheet.octopart.com/PTS647SK38SMTR2LFS-C%26K-Components-datasheet-117317067.pdf?src-supplier=Arrow+Electronics; ComponentLink5URL: http://datasheet.octopart.com/PTS647SK38SMTR2LFS-C%26K-Components-datasheet-117317067.pdf?src-supplier=Verical; ComponentLink5Description: http://datasheet.octopart.com/PTS647SK38SMTR2LFS-C%26K-Components-datasheet-117317067.pdf?src-supplier=Verical; ComponentLink6URL: http://datasheet.octopart.com/PTS647SK38SMTR2LFS-C%26K-Components-datasheet-117317067.pdf?src-supplier=Newark; ComponentLink6Description: http://datasheet.octopart.com/PTS647SK38SMTR2LFS-C%26K-Components-datasheet-117317067.pdf?src-supplier=Newark; ComponentLink7URL: http://datasheet.octopart.com/PTS647SK38SMTR2LFS-C%26K-Components-datasheet-117317067.pdf?src-supplier=Mouser; ComponentLink7Description: http://datasheet.octopart.com/PTS647SK38SMTR2LFS-C%26K-Components-datasheet-117317067.pdf?src-supplier=Mouser; ComponentLink8URL: http://datasheet.octopart.com/PTS647SK38SMTR2LFS-C%26K-Components-datasheet-117317067.pdf?src-supplier=Onlinecomponents.com; ComponentLink8Description: http://datasheet.octopart.com/PTS647SK38SMTR2LFS-C%26K-Components-datasheet-117317067.pdf?src-supplier=Onlinecomponents.com; ComponentLink9URL: http://datasheet.octopart.com/PTS647SK38SMTR2LFS-C%26K-Components-datasheet-117317067.pdf?src-supplier=Allied+Electronics; ComponentLink9Description: http://datasheet.octopart.com/PTS647SK38SMTR2LFS-C%26K-Components-datasheet-117317067.pdf?src-supplier=Allied+Electronics; ComponentLink10URL: https://datasheet.octopart.com/PTS647SK38SMTR2LFS-C%26K-Components-datasheet-156105943.pdf?src-supplier=TME; ComponentLink10Description: https://datasheet.octopart.com/PTS647SK38SMTR2LFS-C%26K-Components-datasheet-156105943.pdf?src-supplier=TME; ComponentLink11URL: http://datasheet.octopart.com/PTS647SK38SMTR2LFS-C%26K-Components-datasheet-117317067.pdf?src-supplier=Electro+Sonic; ComponentLink11Description: http://datasheet.octopart.com/PTS647SK38SMTR2LFS-C%26K-Components-datasheet-117317067.pdf?src-supplier=Electro+Sonic; ComponentLink12URL: http://datasheet.octopart.com/PTS647SK38SMTR2LFS-C%26K-Components-datasheet-117317067.pdf?src-supplier=TTI; ComponentLink12Description: http://datasheet.octopart.com/PTS647SK38SMTR2LFS-C%26K-Components-datasheet-117317067.pdf?src-supplier=TTI; ComponentLink13URL: http://datasheet.octopart.com/PTS647SK38SMTR2LFS-C%26K-Components-datasheet-117317067.pdf?src-supplier=Rutronik; ComponentLink13Description: http://datasheet.octopart.com/PTS647SK38SMTR2LFS-C%26K-Components-datasheet-117317067.pdf?src-supplier=Rutronik; ComponentLink14URL: http://datasheet.octopart.com/PTS647SK38SMTR2LFS-C%26K-Components-datasheet-117317067.pdf?src-supplier=LCSC; ComponentLink14Description: http://datasheet.octopart.com/PTS647SK38SMTR2LFS-C%26K-Components-datasheet-117317067.pdf?src-supplier=LCSC; ComponentLink15URL: http://datasheet.octopart.com/PTS647SK38SMTR2LFS-C%26K-Components-datasheet-117317067.pdf?src-supplier=Sager+Electronics; ComponentLink15Description: http://datasheet.octopart.com/PTS647SK38SMTR2LFS-C%26K-Components-datasheet-117317067.pdf?src-supplier=Sager+Electronics; LCSC Part Number: C2798978
U1 = ESP32-S3-WROOM-1U-N8R8: SMD Module, ESP32-S3R8 With 8 mb; Manufacturer: Espressif Systems; Supplier: Digikey; Supplier Part Number: 1965-ESP32-S3-WROOM-1U-N8R8CT-ND; Manufacturer Part Number: ESP32-S3-WROOM-1U-N8R8; RoHS: No; Category: Uncategorized; Stock: 7165; Pricing: 1=6,13, 10=5,313, 25=5,0276, 100=4,635, 250=4,39984 (USD); ComponentLink1URL: https://datasheet.octopart.com/ESP32-S3-WROOM-1U-N8R8-Espressif-Systems-datasheet-165560563.pdf?src-supplier=TME; ComponentLink1Description: https://datasheet.octopart.com/ESP32-S3-WROOM-1U-N8R8-Espressif-Systems-datasheet-165560563.pdf?src-supplier=TME; LCSC Part Number: C2980300
U2 = TL1963A-33DCYR: IC REG LIN 3.3V 1.5A SOT-223-4; Manufacturer: Texas Instruments; Package Body Material: Plastic; Adjustability: FIXED; Dropout Voltage1-Max: 550mV; Dropout Voltage1-Nom: 340mV; Input Voltage Absolute-Max: 20V; Min Input Voltage: 3.8V; Channels: 1; Output Voltage1-Max: 3.4V; Output Voltage1-Min: 3.2V; Regulator Type: FIXED POSITIVE SINGLE OUTPUT LDO REGULATOR; Voltage Tolerance-Max: 3%; Qualification Status: Not Qualified; Supplier: Digikey; Supplier Part Number: 296-24897-1-ND; Manufacturer Part Number: TL1963A-33DCYR; RoHS: Yes; Category: Voltage Regulators - Linear; Stock: 1756; Pricing: 1=2,76, 10=2,062, 25=1,8864, 100=1,6934, 250=1,60148, 500=1,54604, 1000=1,50041 (USD); Case/Package: SOP; Pins: 4; Package Shape: Rectangular; Terminal Finish: Tin; JESD-609 Code: e3; Max Supply Voltage: 20V; JESD-30 Code: R-PDSO-G4; Moisture Sensitivity Level: 2; Number of Outputs: 1; Operating Temperature, TJ-Max: 125°C; Operating Temperature, TJ-Min: -40°C; Output Current1-Max: 1.5A; Output Voltage1-Nom: 3.3V; Packaging: Tape and Reel; Peak Reflow Temperature (Cel): 260°C; Surface Mount: Yes; Technology: BIPOLAR; Terminal Form: Gull Wing; Terminal Position: DUAL; Length: 6.5mm; Width: 3.5mm; Height - Seated (Max): 1.8mm; Terminal Pitch: 2.3mm; Reach SVHC Compliant: Yes; RoHS Compliant: Yes; ComponentLink1URL: https://www.ti.com:443/lit/ds/symlink/tl1963a.pdf?src-supplier=IHS+Markit; ComponentLink1Description: https://www.ti.com:443/lit/ds/symlink/tl1963a.pdf?src-supplier=IHS+Markit; ComponentLink2URL: https://datasheet.ciiva.com/2046/-2046068.pdf?src-supplier=Digikey; ComponentLink2Description: https://datasheet.ciiva.com/2046/-2046068.pdf?src-supplier=Digikey; LCSC Part Number: C181262
U3 = AD8515ARTZ-REEL7: IC OPAMP GP 1 CIRCUIT SOT23-5; Manufacturer: Analog Devices; Package Body Material: Plastic; Amplifier Type: OPERATIONAL AMPLIFIER; Architecture: VOLTAGE-FEEDBACK; Average Bias Current-Max (IIB): 8nA; Bias Current-Max (IIB) @25C: 30pA; Common-mode Reject Ratio-Nom: 54dB; Frequency Compensation: YES; Input Offset Voltage-Max: 8mV; Low-Offset: No; Channels: 1; Package Equivalence Code: TSOP5/6,.11,37; Power Supplies: 1.8/5V; Slew Rate: 2.7V/µs; Max Supply Current: 600uA; Supply Voltage Limit-Max: 6V; Nominal Supply Voltage: 3V; Time @ Peak Reflow Temperature-Max (s): 40s; Unity Gain BW-Nom: 5MHz; Voltage Gain-Min: 110000; Qualification Status: Not Qualified; Supplier: Digikey; Supplier Part Number: 505-AD8515ARTZ-REEL7CT-ND; Manufacturer Part Number: AD8515ARTZ-REEL7; RoHS: Yes; Category: Amplifiers - Op Amps, Buffer, Instrumentation; Stock: 8412; Pricing: 1=1,92, 10=1,194, 25=1,004, 100=0,7882, 250=0,68224, 500=0,61708, 1000=0,56248 (USD); Case/Package: LSSOP; Pins: 5; Package Shape: Rectangular; Terminal Finish: Tin; Min Operating Temperature: -40°C; Max Operating Temperature: 125°C; JESD-609 Code: e3; JESD-30 Code: R-PDSO-G5; Low-Bias: Yes; Micropower: Yes; Moisture Sensitivity Level: 1; Package Style: SMALL OUTLINE, LOW PROFILE, SHRINK PITCHMeter; Packaging: Tape and Reel; Peak Reflow Temperature (Cel): 260°C; Power: No; Programmable Power: No; Surface Mount: Yes; Technology: CMOS; Terminal Form: Gull Wing; Terminal Position: DUAL; Wideband: No; Length: 2.9mm; Width: 1.6mm; Height - Seated (Max): 1.45mm; Terminal Pitch: 0.95mm; Temperature Grade: AUTOMOTIVE; Reach SVHC Compliant: Yes; RoHS Compliant: Yes; ComponentLink1URL: https://datasheet.ciiva.com:443/pdfs/VipMasterIC/IC/ANDI/ANDI-S-A0002885272/ANDI-S-A0002885272-1.pdf?src-supplier=IHS+Markit; ComponentLink1Description: https://datasheet.ciiva.com:443/pdfs/VipMasterIC/IC/ANDI/ANDI-S-A0002885272/ANDI-S-A0002885272-1.pdf?src-supplier=IHS+Markit; ComponentLink2URL: https://datasheet.ciiva.com/1793/ad8515-1793280.pdf?src-supplier=Digikey; ComponentLink2Description: https://datasheet.ciiva.com/1793/ad8515-1793280.pdf?src-supplier=Digikey; ComponentLink3URL: https://datasheet.ciiva.com/1793/ad8515-1793281.pdf?src-supplier=Digikey; ComponentLink3Description: https://datasheet.ciiva.com/1793/ad8515-1793281.pdf?src-supplier=Digikey; ComponentLink4URL: https://datasheet.ciiva.com/1793/ad8515-1793282.pdf?src-supplier=Digikey; ComponentLink4Description: https://datasheet.ciiva.com/1793/ad8515-1793282.pdf?src-supplier=Digikey; ComponentLink5URL: https://datasheet.ciiva.com/10326/ad8515-10326750.pdf?src-supplier=Avnet; ComponentLink5Description: https://datasheet.ciiva.com/10326/ad8515-10326750.pdf?src-supplier=Avnet; ComponentLink6URL: https://datasheet.ciiva.com/46385/189715-46385032.pdf?src-supplier=Element14; ComponentLink6Description: https://datasheet.ciiva.com/46385/189715-46385032.pdf?src-supplier=Element14; LCSC Part Number: C89478
U4 = SN74LV1T125DBVR: IC BUFF NON-INVERT 5.5V SOT-23-5; Manufacturer: Texas Instruments; Package Body Material: Plastic; Output Polarity: True; Control Type: ENABLE LOW; Load Capacitance (CL): 30pF; Logic Type: BUS DRIVER; Max I(ol): 5.5mA; Number of Bits: 1; Number of Ports: 2; Output Characteristics: 3-STATE; Package Equivalence Code: TSOP5/6,.11,37; Power Supplies: 3.3V; Prop. Delay@Nom-Sup: 9ns; Propagation Delay (tpd): 14.5ns; Min Supply Voltage: 1.6V; Nominal Supply Voltage: 1.8V; Qualification Status: Not Qualified; Supplier: Digikey; Supplier Part Number: 296-37172-1-ND; Manufacturer Part Number: SN74LV1T125DBVR; RoHS: Yes; Category: Integrated Circuits (ICs); Stock: 62099; Pricing: 1=0,38, 10=0,265, 25=0,2364, 100=0,2042, 250=0,18884, 500=0,17962, 1000=0,17201 (USD); Case/Package: LSSOP; Pins: 5; Package Shape: Rectangular; Terminal Finish: Nickel; Min Operating Temperature: -40°C; Max Operating Temperature: 125°C; JESD-609 Code: e4; JESD-30 Code: R-PDSO-G5; Moisture Sensitivity Level: 1; Channels: 1; Package Style: SMALL OUTLINE, LOW PROFILE, SHRINK PITCHMeter; Packaging: Tape and Reel; Max Supply Voltage: 5.5V; Surface Mount: Yes; Technology: CMOS; Terminal Form: Gull Wing; Terminal Position: DUAL; Length: 2.9mm; Width: 1.6mm; Height - Seated (Max): 1.45mm; Terminal Pitch: 0.95mm; Temperature Grade: AUTOMOTIVE; Reach SVHC Compliant: Yes; RoHS Compliant: Yes; ComponentLink1URL: https://www.ti.com:443/lit/ds/symlink/sn74lv1t125.pdf?src-supplier=IHS+Markit; ComponentLink1Description: https://www.ti.com:443/lit/ds/symlink/sn74lv1t125.pdf?src-supplier=IHS+Markit; ComponentLink2URL: https://datasheet.ciiva.com/29888/sn74lv1t125-29888035.pdf?src-supplier=Avnet; ComponentLink2Description: https://datasheet.ciiva.com/29888/sn74lv1t125-29888035.pdf?src-supplier=Avnet; ComponentLink3URL: https://datasheet.ciiva.com/29634/sn74lv1t125-29634743.pdf?src-supplier=Digikey; ComponentLink3Description: https://datasheet.ciiva.com/29634/sn74lv1t125-29634743.pdf?src-supplier=Digikey; ComponentLink4URL: https://datasheet.ciiva.com/29634/sn74lv1t125-29634744.pdf?src-supplier=Digikey; ComponentLink4Description: https://datasheet.ciiva.com/29634/sn74lv1t125-29634744.pdf?src-supplier=Digikey; ComponentLink5URL: https://datasheet.ciiva.com/29634/sn74lv1t125-29634745.pdf?src-supplier=Digikey; ComponentLink5Description: https://datasheet.ciiva.com/29634/sn74lv1t125-29634745.pdf?src-supplier=Digikey; ComponentLink6URL: https://datasheet.ciiva.com/30038/sn74lv1t125-30038267.pdf?src-supplier=Avnet; ComponentLink6Description: https://datasheet.ciiva.com/30038/sn74lv1t125-30038267.pdf?src-supplier=Avnet; LCSC Part Number: C473338